# Altium project QuadcopterDesign.PrjPcb (part 3 of 4)

## Sheet [4] Wifi_ESP32_Antenna.SchDoc
size A4; Organization: UNMEI ELECTRICAL; Address1: 16B/12 Nguyen Du Street; Address2: Da Lat City, LD Province; SheetNumber: 4; SheetTotal: 7
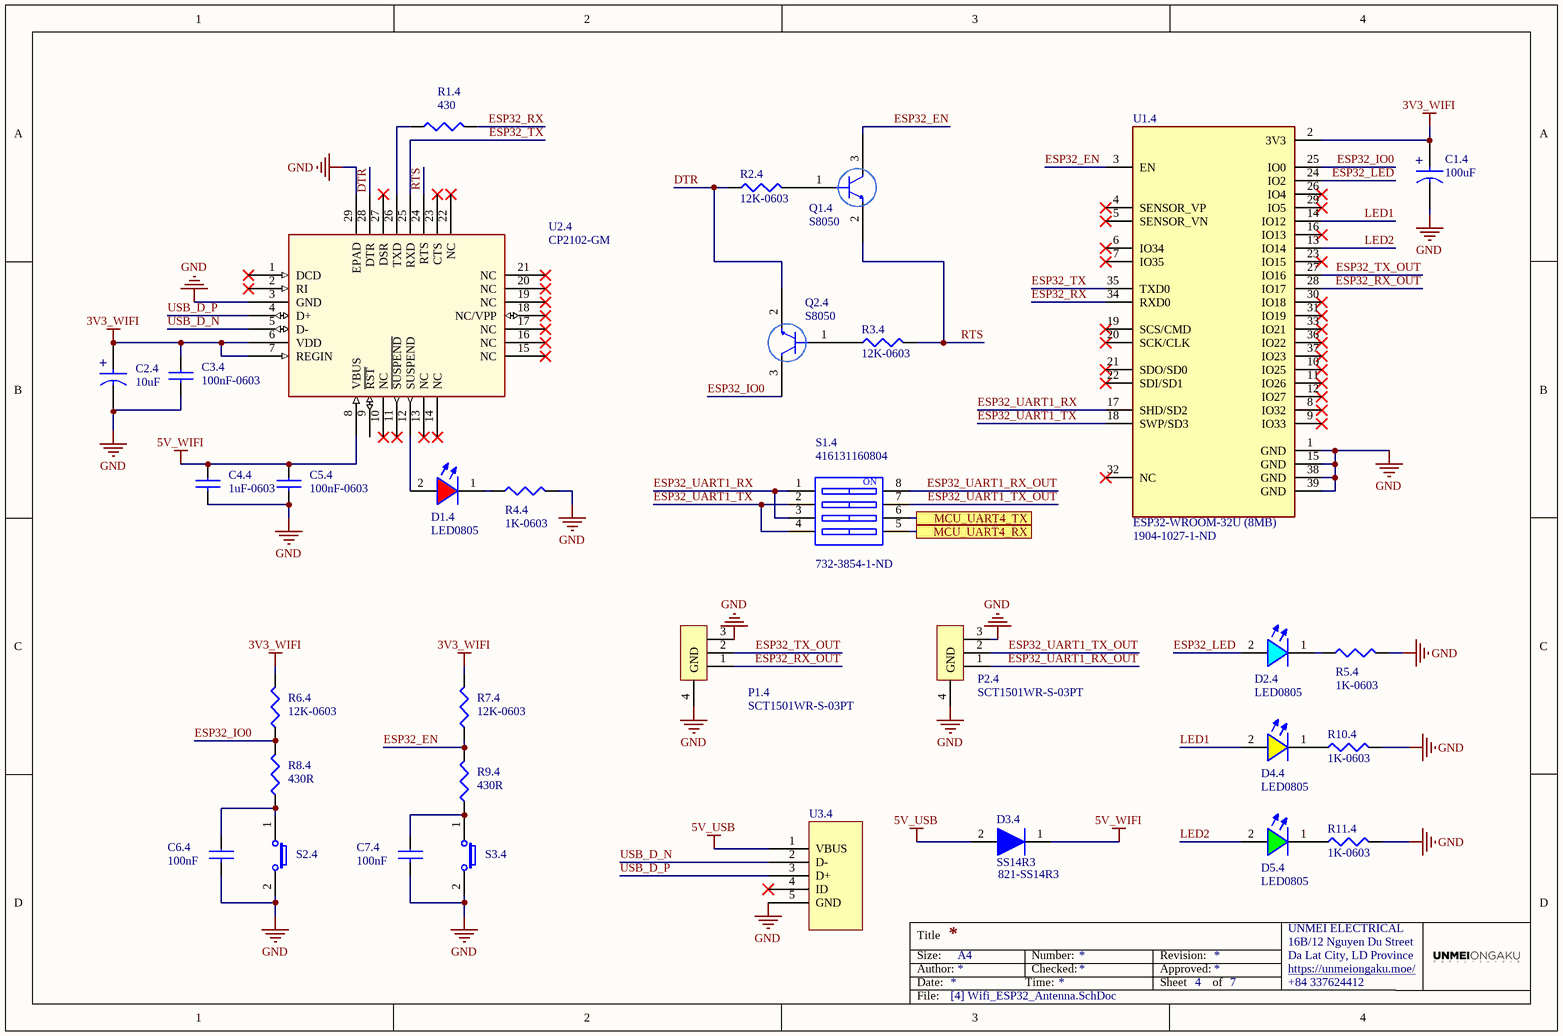
[diagram p3: [4] Wifi_ESP32_Antenna.SchDoc]

### Parts
C1.4  100uF  [Capacitor/Tantalum  - SMD6032/C - AVX]
C2.4  10uF  [Capacitor/Tantalum  - SMD3528/B - AVX]
C3.4  100nF-0603  [CAP0603]
C4.4  1uF-0603  [CAP0603]
C5.4  100nF-0603  [CAP0603]
C6.4  100nF  [CAP0603]
C7.4  100nF  [CAP0603]
D1.4  LED0805  [LED0805-RED]
D2.4  LED0805  [LED0805-BLUE]
D3.4  SS14R3  Supplier Part Number 1: 821-SS14R3  [SS14 - 1N5819 / DO-214AA, SMA]
D4.4  LED0805  [LED0805-YELLOW]
D5.4  LED0805  [LED0805-GREEN]
P1.4  SCT1501WR-S-03PT  [Connector ZH1.5 3P SMD]
P2.4  SCT1501WR-S-03PT  [Connector ZH1.5 3P SMD]
Q1.4  S8050  [SOT23]
Q2.4  S8050  [SOT23]
R1.4  430  [RES0603 - 3D]
R2.4  12K-0603  [RES0603 - 3D]
R3.4  12K-0603  [RES0603 - 3D]
R4.4  1K-0603  [RES0603 - 3D]
R5.4  1K-0603  [RES0603 - 3D]
R6.4  12K-0603  [RES0603 - 3D]
R7.4  12K-0603  [RES0603 - 3D]
R8.4  430R  [RES0603 - 3D]
R9.4  430R  [RES0603 - 3D]
R10.4  1K-0603  [RES0603 - 3D]
R11.4  1K-0603  [RES0603 - 3D]
S1.4  416131160804  Supplier Part Number 1: 732-3854-1-ND  [DIP Switches SMD 1.27mm 4P]
S2.4  434121043816  [Switches-6x3.5x4.3mm]  (value not drawn)
S3.4  434121043816  [Switches-6x3.5x4.3mm]  (value not drawn)
U1.4  ESP32-WROOM-32U (8MB)  Supplier Part Number 1: 1904-1027-1-ND  [ESP32 WROOM 32U]
U2.4  CP2102-GM  [QFN28_5X5_SIL]
U3.4  Micro USB - UJ2-MIBH-G-SMT-TR  [Micro USB V2 SMD]  (value not drawn)

### Ports
MCU_UART4_RX, MCU_UART4_TX

### Nets
3V3_WIFI: C1.4.1 C2.4.1 C3.4.1 R6.4.2 R7.4.2 U1.4.2(3V3) U2.4.6(VDD) U2.4.7(REGIN)
5V_USB: D3.4.2 U3.4.1(VBUS)
5V_WIFI: C4.4.1 C5.4.1 D3.4.1 U2.4.8(VBUS)
GND: C1.4.2 C2.4.2 C3.4.2 C4.4.2 C5.4.2 C6.4.2 C7.4.2 P1.4.3 P1.4.4(GND) P2.4.3 P2.4.4(GND) R4.4.2 R5.4.2 R10.4.2 R11.4.2 S2.4.2 S3.4.2 U1.4.1(GND) U1.4.15(GND) U1.4.38(GND) U1.4.39(GND) U2.4.3(GND) U2.4.29(EPAD) U3.4.5(GND)
DTR: Q2.4.2 R2.4.1 U2.4.28(DTR)
ESP32_EN: Q1.4.3 R7.4.1 R9.4.2 U1.4.3(EN)
ESP32_IO0: Q2.4.3 R6.4.1 R8.4.2 U1.4.25(IO0)
ESP32_LED: D2.4.2(+) U1.4.24(IO2)
ESP32_RX: R1.4.2 U1.4.34(RXD0)
ESP32_RX_OUT: P1.4.1 U1.4.28(IO17)
ESP32_TX: U1.4.35(TXD0) U2.4.25(RXD)
ESP32_TX_OUT: P1.4.2 U1.4.27(IO16)
ESP32_UART1_RX: S1.4.1 S1.4.3 U1.4.17(SHD/SD2)
ESP32_UART1_RX_OUT: P2.4.1 S1.4.8
ESP32_UART1_TX: S1.4.2 S1.4.4 U1.4.18(SWP/SD3)
ESP32_UART1_TX_OUT: P2.4.2 S1.4.7
LED1: D4.4.2(+) U1.4.14(IO12)
LED2: D5.4.2(+) U1.4.13(IO14)
MCU_UART4_RX: S1.4.5 ; port MCU_UART4_RX
MCU_UART4_TX: S1.4.6 ; port MCU_UART4_TX
RTS: Q1.4.2 R3.4.2 U2.4.24(RTS)
USB_D_N: U2.4.5(D-) U3.4.2(D-)
USB_D_P: U2.4.4(D+) U3.4.3(D+)
NetC6.4_1: C6.4.1 R8.4.1 S2.4.1
NetC7.4_1: C7.4.1 R9.4.1 S3.4.1
NetD1.4_1: D1.4.1(+) R4.4.1
NetD1.4_2: D1.4.2(+) U2.4.12(SUSPEND)
NetD2.4_1: D2.4.1(+) R5.4.1
NetD4.4_1: D4.4.1(+) R10.4.1
NetD5.4_1: D5.4.1(+) R11.4.1
NetQ1.4_1: Q1.4.1 R2.4.2
NetQ2.4_1: Q2.4.1 R3.4.1
NetR1.4_1: R1.4.1 U2.4.26(TXD)

Not connected (* = marked no-connect by the designer): U1.4 4(SENSOR_VP)* 5(SENSOR_VN)* 6(IO34)* 7(IO35)* 8(IO32)* 9(IO33)* 10(IO25)* 11(IO26)* 12(IO27)* 16(IO13)* 19(SCS/CMD)* 20(SCK/CLK)* 21(SDO/SD0)* 22(SDI/SD1)* 23(IO15)* 26(IO4)* 29(IO5)* 30(IO18)* 31(IO19)* 32(NC)* 33(IO21)* 36(IO22)* 37(IO23)*; U2.4 1(DCD)* 2(RI)* 9(~{RST}) 10(NC)* 11(~{SUSPEND})* 13(NC)* 14(NC)* 15(NC)* 16(NC)* 17(NC)* 18(NC/VPP)* 19(NC)* 20(NC)* 21(NC)* 22(NC)* 23(CTS)* 27(DSR)*; U3.4 4(ID)*

### Notes on the sheet
- Title
- Size:
- Date:
- Author:
- A4
- Time:
- Number:
- Checked:
- Revision:
- Sheet
- Approved:
- of
- https://unmeiongaku.moe/
- +84 337624412
- File:
- (in symbol 416131160804) ON
- (in symbol TAJB106K016RNJ) +
- (in symbol TAJC107K006RNJ) +

### Library data of the parts
C1.4 = TAJC107K006RNJ: 钽电容 100uF ±10% 6.3V 0.9Ω C型6032; Manufacturer: Kyocera AVX; Dielectric Material: Tantalum; ESR (Equivalent Series Resistance): 900mR; Leakage Current: 6.3uA; Polarity: Polar; Dissipation Factor: 6%; Supplier 1: RSComponents; Manufacturer Part Number: TAJC107K006RNJ; RoHS: Yes; Category: Tantalum Capacitors; Stock 1: 1; Pricing 1: 20=0.52900, 100=0.36400, 400=0.34700, 1000=0.21400 (USD); Mount: Surface Mount; Case/Package: Molded; Case Code (Metric): 6032; Case Code (Imperial): 2312; Min Operating Temperature: -55°C; Max Operating Temperature: 125°C; Capacitance: 100uF; Tolerance: 10%; Packaging: Tape and Reel; Voltage Rating: 6.3V; Package Quantity: 1; Termination: SMD/SMT; Features: General Purpose; Series: TAJ; Construction: Flat; Length: 6mm; Width: 3.2mm; Height: 2.6mm; Depth: 3.2mm; Height - Seated (Max): 0.11inch; Radiation Hardening: No; REACH SVHC: No SVHC; Lead Free: Lead Free; RoHS Compliant: Yes; ComponentLink1URL: https://datasheet.ciiva.com/26341/559444-da-01-en-tacc-c-6-0-mm-x-3-2-mm-x-2-6-mm-100-uf-26341781.pdf?src-supplier=Conrad; ComponentLink1Description: https://datasheet.ciiva.com/26341/559444-da-01-en-tacc-c-6-0-mm-x-3-2-mm-x-2-6-mm-100-uf-26341781.pdf?src-supplier=Conrad; ComponentLink2URL: https://datasheet.ciiva.com/18710/taj-eng-18710877.pdf?src-supplier=Distrelec; ComponentLink2Description: https://datasheet.ciiva.com/18710/taj-eng-18710877.pdf?src-supplier=Distrelec; ComponentLink3URL: https://datasheet.ciiva.com/7720/1680476-7720614.pdf?src-supplier=Element14; ComponentLink3Description: https://datasheet.ciiva.com/7720/1680476-7720614.pdf?src-supplier=Element14; ComponentLink4URL: https://datasheet.ciiva.com/7720/1680476-7720613.pdf?src-supplier=Element14; ComponentLink4Description: https://datasheet.ciiva.com/7720/1680476-7720613.pdf?src-supplier=Element14; ComponentLink5URL: https://datasheet.ciiva.com/264/taj-264329.pdf?src-supplier=Digi-Key; ComponentLink5Description: https://datasheet.ciiva.com/264/taj-264329.pdf?src-supplier=Digi-Key; ComponentLink6URL: https://datasheet.ciiva.com/264/taj-264328.pdf?src-supplier=Digi-Key; ComponentLink6Description: https://datasheet.ciiva.com/264/taj-264328.pdf?src-supplier=Digi-Key; ComponentLink7URL: https://datasheet.ciiva.com/264/taj-264330.pdf?src-supplier=Digi-Key; ComponentLink7Description: https://datasheet.ciiva.com/264/taj-264330.pdf?src-supplier=Digi-Key; ComponentLink8URL: https://datasheet.ciiva.com/12910/taj-27497-12910474.pdf?src-supplier=Mouser; ComponentLink8Description: https://datasheet.ciiva.com/12910/taj-27497-12910474.pdf?src-supplier=Mouser; ComponentLink9URL: https://datasheet.ciiva.com/3004/taj-3004480.pdf?src-supplier=Avnet; ComponentLink9Description: https://datasheet.ciiva.com/3004/taj-3004480.pdf?src-supplier=Avnet; ComponentLink10URL: https://datasheet.ciiva.com/3004/taj-3004481.pdf?src-supplier=Avnet; ComponentLink10Description: https://datasheet.ciiva.com/3004/taj-3004481.pdf?src-supplier=Avnet; Supplier Part Number 1: 1364517
C2.4 = TAJB106K016RNJ: 钽电容 10uF ±10% 16V 2.8Ω B型3528; Manufacturer: Kyocera AVX; Dielectric Material: Tantalum; ESR (Equivalent Series Resistance): 2.8R; Leakage Current: 1.6uA; Voltage: 10V; Dissipation Factor: 6%; Polarity: Polar; Supplier 1: Newark; Manufacturer Part Number: TAJB106K016RNJ; RoHS: Yes; Category: Tantalum Capacitors; Stock 1: 2000; Pricing 1: 1=0.15600, 2000=0.15600 (USD); Mount: Surface Mount,PCB; Case/Package: 1210; Number of Pins: 2; Case Code (Metric): 3528; Case Code (Imperial): 1210; Min Operating Temperature: -55°C; Max Operating Temperature: 125°C; Capacitance: 10uF; Tolerance: 10%; Packaging: Tape and Reel; Voltage Rating (DC): 16V; Package Quantity: 1; Voltage Rating: 16V; Termination: SMD/SMT; Features: General Purpose; Series: TAJ; Construction: Flat; Length: 3.5mm; Width: 0.11inch; Height: 1.9mm; Depth: 2.8mm; Height - Seated (Max): 0.083inch; Lead Pitch: 1.4mm; Radiation Hardening: No; REACH SVHC: No SVHC; Lead Free: Lead Free; RoHS Compliant: Yes; ComponentLink1URL: https://datasheet.ciiva.com/26341/559424-da-01-en-tacc-b-3-2-mm-x-2-5-mm-x-1-9-mm-10-uf-26341768.pdf?src-supplier=Conrad; ComponentLink1Description: https://datasheet.ciiva.com/26341/559424-da-01-en-tacc-b-3-2-mm-x-2-5-mm-x-1-9-mm-10-uf-26341768.pdf?src-supplier=Conrad; ComponentLink2URL: https://datasheet.ciiva.com/18710/taj-eng-18710629.pdf?src-supplier=Distrelec; ComponentLink2Description: https://datasheet.ciiva.com/18710/taj-eng-18710629.pdf?src-supplier=Distrelec; ComponentLink3URL: https://datasheet.ciiva.com/7730/1680476-7730725.pdf?src-supplier=Element14; ComponentLink3Description: https://datasheet.ciiva.com/7730/1680476-7730725.pdf?src-supplier=Element14; ComponentLink4URL: https://datasheet.ciiva.com/28608/taj-28608982.pdf?src-supplier=Element14; ComponentLink4Description: https://datasheet.ciiva.com/28608/taj-28608982.pdf?src-supplier=Element14; ComponentLink5URL: https://datasheet.ciiva.com/263/taj-263602.pdf?src-supplier=Digi-Key; ComponentLink5Description: https://datasheet.ciiva.com/263/taj-263602.pdf?src-supplier=Digi-Key; ComponentLink6URL: https://datasheet.ciiva.com/263/taj-263601.pdf?src-supplier=Digi-Key; ComponentLink6Description: https://datasheet.ciiva.com/263/taj-263601.pdf?src-supplier=Digi-Key; ComponentLink7URL: https://datasheet.ciiva.com/263/taj-263603.pdf?src-supplier=Digi-Key; ComponentLink7Description: https://datasheet.ciiva.com/263/taj-263603.pdf?src-supplier=Digi-Key; ComponentLink8URL: https://datasheet.ciiva.com/12911/taj-27497-12911721.pdf?src-supplier=Mouser; ComponentLink8Description: https://datasheet.ciiva.com/12911/taj-27497-12911721.pdf?src-supplier=Mouser; ComponentLink9URL: https://datasheet.ciiva.com/14587/70001050-14587351.pdf?src-supplier=Allied+Electronics; ComponentLink9Description: https://datasheet.ciiva.com/14587/70001050-14587351.pdf?src-supplier=Allied+Electronics; ComponentLink10URL: https://datasheet.ciiva.com/3004/taj-3004425.pdf?src-supplier=Avnet; ComponentLink10Description: https://datasheet.ciiva.com/3004/taj-3004425.pdf?src-supplier=Avnet; ComponentLink11URL: https://datasheet.ciiva.com/16385/taj-16385095.pdf?src-supplier=Future+Electronics; ComponentLink11Description: https://datasheet.ciiva.com/16385/taj-16385095.pdf?src-supplier=Future+Electronics; ComponentLink12URL: https://datasheet.ciiva.com/15163/getdatasheetpartid-120870-15163420.pdf?src-supplier=Verical; ComponentLink12Description: https://datasheet.ciiva.com/15163/getdatasheetpartid-120870-15163420.pdf?src-supplier=Verical; ComponentLink13URL: https://datasheet.ciiva.com/25913/taj-25913340.pdf?src-supplier=Avnet+Europe; ComponentLink13Description: https://datasheet.ciiva.com/25913/taj-25913340.pdf?src-supplier=Avnet+Europe; ComponentLink14URL: https://datasheet.ciiva.com/16538/taj-16538428.pdf?src-supplier=Avnet+Asia; ComponentLink14Description: https://datasheet.ciiva.com/16538/taj-16538428.pdf?src-supplier=Avnet+Asia; Supplier Part Number 1: 30H0311
C3.4 C5.4 = CC0603KRX7R9BB104: CAP CER 0.1UF 50V X7R 0603; Manufacturer 1: Yageo; Category 1: Capacitors; Capacitance: 0.1µF; Tolerance: ±10%; Value: 100nF; Supplier 1: Digi-Key; Supplier Part Number 1: 311-1344-1-ND; Manufacturer Part Number 1: CC0603KRX7R9BB104; RoHS 1: RoHS Compliant; Description 1: CAP CER 0.1UF 50V X7R 0603; Stock 1: 4411645; Pricing 1: 1=0.1, 10=0.031, 100=0.014, 500=0.00998, 1000=0.00783 (USD); Packaging: Cut Tape (CT); Part Status: Active; Voltage - Rated: 50V; Temperature Coefficient: X7R; Operating Temperature: -55°C ~ 125°C; Features: -; Ratings: -; Applications: General Purpose; Failure Rate: -; Mounting Type: Surface Mount, MLCC; Package / Case: 0603 (1608 Metric); Size / Dimension: 0.063" L x 0.031" W (1.60mm x 0.80mm); Height - Seated (Max): -; Thickness (Max): 0.035" (0.90mm); Lead Spacing: -; Lead Style: -; ComponentLink1URL: http://www.yageo.com/documents/recent/UPY-GPHC_X7R_6.3V-to-50V_18.pdf; ComponentLink1Description: http://www.yageo.com/documents/recent/UPY-GPHC_X7R_6.3V-to-50V_18.pdf
C4.4 = CC0603KRX7R7BB105: CAP CER 1UF 16V X7R 0603; Manufacturer 1: Yageo; Category 1: Capacitors; Capacitance: 1µF; Tolerance: ±10%; Supplier 1: Digi-Key; Supplier Part Number 1: 311-1446-1-ND; Manufacturer Part Number 1: CC0603KRX7R7BB105; RoHS 1: RoHS Compliant; Description 1: CAP CER 1UF 16V X7R 0603; Stock 1: 274580; Pricing 1: 1=0.1, 10=0.051, 100=0.0227, 500=0.0162, 1000=0.01274 (USD); Packaging: Cut Tape (CT); Part Status: Active; Voltage - Rated: 16V; Temperature Coefficient: X7R; Operating Temperature: -55°C ~ 125°C; Features: -; Ratings: -; Applications: General Purpose; Failure Rate: -; Mounting Type: Surface Mount, MLCC; Package / Case: 0603 (1608 Metric); Size / Dimension: 0.063" L x 0.031" W (1.60mm x 0.80mm); Height - Seated (Max): -; Thickness (Max): 0.035" (0.90mm); Lead Spacing: -; Lead Style: -; ComponentLink1URL: http://www.yageo.com/documents/recent/UPY-GPHC_X7R_6.3V-to-50V_18.pdf; ComponentLink1Description: http://www.yageo.com/documents/recent/UPY-GPHC_X7R_6.3V-to-50V_18.pdf; Value: 1uF
C6.4 C7.4 = CC0603KRX7R9BB104: as C1.2 on sheet [2] MicroController; Supplier 1: Digi-Key; Supplier Part Number 1: 311-1344-1-ND; Manufacturer Part Number 1: CC0603KRX7R9BB104; RoHS 1: RoHS Compliant; Description 1: CAP CER 0.1UF 50V X7R 0603; Stock 1: 4411645; Pricing 1: 1=0.1, 10=0.031, 100=0.014, 500=0.00998, 1000=0.00783 (USD); Packaging: Cut Tape (CT); Part Status: Active; Voltage - Rated: 50V; Temperature Coefficient: X7R; Operating Temperature: -55°C ~ 125°C; Features: -; Ratings: -; Applications: General Purpose; Failure Rate: -; Mounting Type: Surface Mount, MLCC; Package / Case: 0603 (1608 Metric); Size / Dimension: 0.063" L x 0.031" W (1.60mm x 0.80mm); Height - Seated (Max): -; Thickness (Max): 0.035" (0.90mm); Lead Spacing: -; Lead Style: -; ComponentLink1URL: http://www.yageo.com/documents/recent/UPY-GPHC_X7R_6.3V-to-50V_18.pdf; ComponentLink1Description: http://www.yageo.com/documents/recent/UPY-GPHC_X7R_6.3V-to-50V_18.pdf; Value: 100nF
D1.4 = LED0805-RED
D2.4 = LED0805-BLUE
D3.4 = SS14R3: 1A, 40V, Schottky Rectifier; Manufacturer: Taiwan Semiconductor; Supplier 1: Mouser; Manufacturer Part Number: SS14R3; RoHS: Yes; Category: Uncategorized; Stock 1: 5400; Pricing 1: 3600=0.07700, 9000=0.06800, 10000=0.06800, 23400=0.06400, 48600=0.05800 (USD); Case/Package: SMA; Number of Pins: 2; ComponentLink1URL: http://components.arrow.com/part/dataview/0323_01151906?src-supplier=Arrow+Europe; ComponentLink1Description: http://components.arrow.com/part/dataview/0323_01151906?src-supplier=Arrow+Europe
D4.4 = LED0805-YELLOW
D5.4 = LED0805-GREEN
Q1.4 Q2.4 = MMS8050-H-TP: Trans Gp Bjt NPN 25V 0.5A 3-PIN SOT-23 T/r; Manufacturer: MCC; Max Collector Current: 500mA; Collector Emitter Voltage (VCEO): 600mV; Max Power Dissipation: 300mW; Transition Frequency: 150MHz; Supplier 1: Mouser; Manufacturer Part Number: MMS8050-H-TP; RoHS: Yes; Category: Uncategorized; Stock 1: 417; Pricing 1: 1=0.21000, 10=0.17100, 50=0.17100, 100=0.09100, 1000=0.04100, 10000=0.02700 (USD); Mount: Surface Mount; Case/Package: TO-236-3; Number of Pins: 3; Min Operating Temperature: -55°C; Max Operating Temperature: 150°C; Packaging: Tape and Reel; Collector Emitter Breakdown Voltage: 25V; RoHS Compliant: Yes; ComponentLink1URL: http://components.arrow.com/part/dataview/56206496S302966N2022?src-supplier=Arrow+Electronics; ComponentLink1Description: http://components.arrow.com/part/dataview/56206496S302966N2022?src-supplier=Arrow+Electronics; ComponentLink2URL: http://www.mccsemi.com/up_pdf/MMS8050(SOT-23).pdf?src-supplier=Digi-Key; ComponentLink2Description: http://www.mccsemi.com/up_pdf/MMS8050(SOT-23).pdf?src-supplier=Digi-Key; Supplier Part Number 1: 833-MMS8050-H-TP
R1.4 = RC0603JR-07430RL: Res Thick Film 0603 430 Ohm 5% 0.1W(1/10W) ±100ppm/C Pad SMD T/R; Manufacturer: Yageo; Resistance: 430R; Power Rating: 100mW; Voltage Rating: 75V; Temperature Coefficient: 100ppm/°C; Voltage Rating (DC): 50V; Supplier 1: Arrow Electronics; Manufacturer Part Number: RC0603JR-07430RL; RoHS: Yes; Category: Chip SMD Resistors; Stock 1: 4860; Pricing 1: 1=0.08790, 10=0.01230, 25=0.01220, 100=0.00530, 250=0.00520, 1000=0.00260, 3000=0.00190 (USD); Case/Package: 0603; Case Code (Metric): 1608; Case Code (Imperial): 0603; Weight: 7.1E-05oz; Size Code: 0603; Min Operating Temperature: -55°C; Max Operating Temperature: 155°C; Package Quantity: 1; Tolerance: 5%; Packaging: Tape and Reel; Resistor Type: Thick Film; Number of Terminations: 2; Termination: SMD/SMT; Max Power Dissipation: 100mW; Features: Moisture Resistant; Series: RC; Construction: Rectangular; Length: 1.6mm; Width: 0.031inch; Height: 0.022inch; Depth: 0.8mm; Military Standard: Not; Lead Free: Lead Free; RoHS Compliant: Yes; ComponentLink1URL: https://datasheet.ciiva.com/2452/pyu-r-int-thick-7-2452930.pdf?src-supplier=Digi-Key; ComponentLink1Description: https://datasheet.ciiva.com/2452/pyu-r-int-thick-7-2452930.pdf?src-supplier=Digi-Key; ComponentLink2URL: https://datasheet.ciiva.com/2452/pyu-r-int-thick-7-2452931.pdf?src-supplier=Digi-Key; ComponentLink2Description: https://datasheet.ciiva.com/2452/pyu-r-int-thick-7-2452931.pdf?src-supplier=Digi-Key; ComponentLink3URL: https://datasheet.ciiva.com/2452/pyu-r-int-thick-7-2452929.pdf?src-supplier=Digi-Key; ComponentLink3Description: https://datasheet.ciiva.com/2452/pyu-r-int-thick-7-2452929.pdf?src-supplier=Digi-Key; Supplier Part Number 1: RC0603JR-07430RL
R2.4 R3.4 R6.4 R7.4 = RC0603JR-0712KL: Thick Film Resistors - SMD 12K OHM 5%; Manufacturer: Yageo; Power Rating: 100 mW (1/10 W); Resistance: 12 kOhms; Temperature Coefficient: 100 PPM / C; Voltage Rating: 75 V; Supplier 1: Mouser; Manufacturer Part Number: RC0603JR-0712KL; RoHS: RoHS Compliant; Category: Thick Film Resistors - SMD; Stock 1: 29553; Pricing 1: 1=0.100, 10=0.008, 100=0.002, 5000=0.002 (USD); Features: RC0603 series chip resistors with lead-free terminations; Height: 0.45 mm; Length: 1.6 mm; Package / Case: 0603 (1608 metric); Packaging: Cut Tape; Product: Thick Film Resistors General Purpose; Series: RC-L; Termination Style: SMD/SMT; Tolerance: 5 %; Type: General Purpose Resistor; Width: 0.8 mm; Brand: Yageo; Case Code - in: 0603; Case Code - mm: 1608; Maximum Operating Temperature: + 155 C; Minimum Operating Temperature: - 55 C; Standard Pack Qty: 5000; RoHS - Mouser: Y; Minimum Order Quantity: 1; Reeling: True; ComponentLink1URL: https://www.mouser.com/ds/2/447/RC0603-1212058.pdf; ComponentLink1Description: https://www.mouser.com/ds/2/447/RC0603-1212058.pdf; Supplier Part Number 1: 603-RC0603JR-0712KL; Value: 12K
R4.4 R5.4 R10.4 R11.4 = RC0603JR-071KL: RES SMD 1K OHM 5% 1/10W 0603; Manufacturer 1: Yageo; Category 1: Resistors; Power (Watts): 0.1W, 1/10W; Temperature Coefficient: ±100ppm/°C; Supplier 1: Digi-Key; Supplier Part Number 1: 311-1.0KGRCT-ND; Manufacturer Part Number 1: RC0603JR-071KL; RoHS 1: RoHS Compliant; Description 1: RES SMD 1K OHM 5% 1/10W 0603; Stock 1: 2853955; Pricing 1: 1=0.1, 10=0.011, 100=0.0044, 1000=0.00198, 2500=0.00172 (USD); Packaging: Cut Tape (CT); Part Status: Active; Resistance (Ohms): 1k; Tolerance: ±5%; Composition: Thick Film; Features: Moisture Resistant; Operating Temperature: -55°C ~ 155°C; Package / Case: 0603 (1608 Metric); Supplier Device Package: 0603; Size / Dimension: 0.063" L x 0.031" W (1.60mm x 0.80mm); Height - Seated (Max): 0.022" (0.55mm); Failure Rate: -; ComponentLink1URL: http://www.yageo.com/documents/recent/PYu-RC_Group_51_RoHS_L_7.pdf; ComponentLink1Description: http://www.yageo.com/documents/recent/PYu-RC_Group_51_RoHS_L_7.pdf; Value: 1K
R8.4 R9.4 = RC0603JR-07430RL: Res Thick Film 0603 430 Ohm 5% 0.1W(1/10W) ±100ppm/C Pad SMD T/R; Manufacturer: Yageo; Power Rating: 100mW; Voltage Rating: 75V; Temperature Coefficient: 100ppm/°C; Voltage Rating (DC): 50V; Supplier 1: Arrow Electronics; Manufacturer Part Number: RC0603JR-07430RL; RoHS: Yes; Category: Chip SMD Resistors; Stock 1: 4860; Pricing 1: 1=0.08790, 10=0.01230, 25=0.01220, 100=0.00530, 250=0.00520, 1000=0.00260, 3000=0.00190 (USD); Case/Package: 0603; Case Code (Metric): 1608; Case Code (Imperial): 0603; Weight: 7.1E-05oz; Size Code: 0603; Min Operating Temperature: -55°C; Max Operating Temperature: 155°C; Package Quantity: 1; Resistance: 430R; Tolerance: 5%; Packaging: Tape and Reel; Resistor Type: Thick Film; Number of Terminations: 2; Termination: SMD/SMT; Max Power Dissipation: 100mW; Features: Moisture Resistant; Series: RC; Construction: Rectangular; Length: 1.6mm; Width: 0.031inch; Height: 0.022inch; Depth: 0.8mm; Military Standard: Not; Lead Free: Lead Free; RoHS Compliant: Yes; ComponentLink1URL: https://datasheet.ciiva.com/2452/pyu-r-int-thick-7-2452930.pdf?src-supplier=Digi-Key; ComponentLink1Description: https://datasheet.ciiva.com/2452/pyu-r-int-thick-7-2452930.pdf?src-supplier=Digi-Key; ComponentLink2URL: https://datasheet.ciiva.com/2452/pyu-r-int-thick-7-2452931.pdf?src-supplier=Digi-Key; ComponentLink2Description: https://datasheet.ciiva.com/2452/pyu-r-int-thick-7-2452931.pdf?src-supplier=Digi-Key; ComponentLink3URL: https://datasheet.ciiva.com/2452/pyu-r-int-thick-7-2452929.pdf?src-supplier=Digi-Key; ComponentLink3Description: https://datasheet.ciiva.com/2452/pyu-r-int-thick-7-2452929.pdf?src-supplier=Digi-Key; Supplier Part Number 1: RC0603JR-07430RL
S1.4 = 416131160804: DIP Switch Dimensions L x W x H: 5.6 x 2 mm Series: WS-DISV L: 6.12 mm Poles: 4; Manufacturer: Wurth Electronics; Body Material: Polyphenylene,Polyphthalamide; Mechanical Life: 2000Cycles; Contact Resistance: 50mR; Contact Current Rating: 25mA; Number of Positions: 4; Voltage Rating (DC): 24V; Electrical Life: 1000Cycles; Throw Configuration: SPST; Insulation Resistance: 100MR; Actuator Type: Slide (Standard); Pitch: 0.05inch; Washable: Yes; Supplier 1: Digi-Key; Manufacturer Part Number: 416131160804; RoHS: Yes; Category: DIP Switches; Stock 1: 13030; Pricing 1: 1=5.25000, 10=5.08200, 50=4.81400, 100=4.27900, 500=4.01200 (USD); Mount: Surface Mount; Contact Material: Copper Alloy,Gold; Contact Plating: Gold; Min Operating Temperature: -40°C; Max Operating Temperature: 85°C; Package Quantity: 1; Packaging: Cut Tape; Current Rating: 25mA; Termination: Gull Wing; Number of Circuits: 4; Max Voltage Rating (DC): 24V; Series: WS-DISV; Length: 0.241inch; Width: 5.6mm; Height: 2mm; Reach SVHC Compliant: Yes; Lead Free: Lead Free; RoHS Compliant: Yes; ComponentLink1URL: https://datasheet.ciiva.com/30467/0900766b812902d9-30467107.pdf?src-supplier=RSComponents; ComponentLink1Description: https://datasheet.ciiva.com/30467/0900766b812902d9-30467107.pdf?src-supplier=RSComponents; ComponentLink2URL: https://datasheet.ciiva.com/1528/4161311608xx-1528928.pdf?src-supplier=Element14; ComponentLink2Description: https://datasheet.ciiva.com/1528/4161311608xx-1528928.pdf?src-supplier=Element14; ComponentLink3URL: https://datasheet.ciiva.com/2863/4161311608xx-2863702.pdf?src-supplier=Digi-Key; ComponentLink3Description: https://datasheet.ciiva.com/2863/4161311608xx-2863702.pdf?src-supplier=Digi-Key; ComponentLink4URL: https://datasheet.ciiva.com/2863/4161311608xx-2863701.pdf?src-supplier=Digi-Key; ComponentLink4Description: https://datasheet.ciiva.com/2863/4161311608xx-2863701.pdf?src-supplier=Digi-Key; ComponentLink5URL: https://datasheet.ciiva.com/1625/4161311608xx-1625344.pdf?src-supplier=Farnell; ComponentLink5Description: https://datasheet.ciiva.com/1625/4161311608xx-1625344.pdf?src-supplier=Farnell
S2.4 S3.4 = 434121043816: Switch Tactile Spst-no 0.05A 12V; Manufacturer: Wurth Electronics; Mechanical Life: 50000Cycles; Actuator Material: Polymer,Liquid Crystal Polymer; Contact Current Rating: 50mA; Operating Force: 160gf; Illumination Type: Non-Illuminated,Illuminated; Throw Configuration: SPST; Insulation Resistance: 100MR; Switch Travel: 0.25mm; Switch Function: Off-Mom; Actuator Length: 0.8mm; Supplier 1: RSComponents; Manufacturer Part Number: 434121043816; RoHS: Yes; Category: Tactile Switches; Stock 1: 337; Pricing 1: 1=1.69500 (USD); Mount: Surface Mount; Contact Material: Stainless Steel,Steel; Min Operating Temperature: -40°C; Max Operating Temperature: 85°C; Current Rating: 50mA; Packaging: Tape and Reel; Termination: SMD/SMT; Series: WS-TASV; Contact Type: 1 maker; Length: 8mm; Width: 3.5mm; Height: 4.3mm; REACH SVHC: No SVHC; RoHS Compliant: Yes; ComponentLink1URL: https://datasheet.ciiva.com/30466/0900766b8126b631-30466746.pdf?src-supplier=RSComponents; ComponentLink1Description: https://datasheet.ciiva.com/30466/0900766b8126b631-30466746.pdf?src-supplier=RSComponents; ComponentLink2URL: https://datasheet.ciiva.com/29123/711754-da-01-en-taster-434121043816-29123819.pdf?src-supplier=Conrad; ComponentLink2Description: https://datasheet.ciiva.com/29123/711754-da-01-en-taster-434121043816-29123819.pdf?src-supplier=Conrad; ComponentLink3URL: https://datasheet.ciiva.com/1532/434121043816-1532524.pdf?src-supplier=Element14; ComponentLink3Description: https://datasheet.ciiva.com/1532/434121043816-1532524.pdf?src-supplier=Element14; ComponentLink4URL: https://datasheet.ciiva.com/1633/434121043816-1633934.pdf?src-supplier=Farnell; ComponentLink4Description: https://datasheet.ciiva.com/1633/434121043816-1633934.pdf?src-supplier=Farnell; Supplier Part Number 1: 7856421
U1.4 = ESP32-WROOM-32U (8MB): SMD Module, ESP32-D0WD, 64MBITS Spi Flash, Uart Mode, U.fl Antenna Connector; Manufacturer: Espressif Systems; Interface: I2C,SPI,GPIO,PWM,SDIO,UART; Frequency: 2.5GHz; Data Rate: 150Mbps; Sensitivity: -98dBm; Memory Size: 536KB; Resistance: 4.48kR; Tolerance: 0.1%; Max Power Dissipation: 125mW; Temperature Coefficient: 25ppm/°C; Supplier 1: Digi-Key; Manufacturer Part Number: ESP32-WROOM-32U (8MB); RoHS: No; Category: RF Receivers, Transceivers; Mount: Surface Mount; Case/Package: SMD/SMT; Case Code (Imperial): 0805; Case Code (Metric): 2012; Min Operating Temperature: -40°C; Max Operating Temperature: 85°C; Packaging: Cut Tape; Resistor Type: Thin Film; Number of Terminations: 2; ComponentLink1URL: https://www.espressif.com/sites/default/files/documentation/esp32-wroom-32d_esp32-wroom-32u_datasheet_en.pdf?src-supplier=Digi-Key; ComponentLink1Description: https://www.espressif.com/sites/default/files/documentation/esp32-wroom-32d_esp32-wroom-32u_datasheet_en.pdf?src-supplier=Digi-Key
U2.4 = CP2102-GM: Vendor: Silicon Labs; Built_By: EMA_UL_Team; SourceLibrary: Silicon_Labs_2015-03-23; Manufacturer_Part_Number: CP2102-GM; Copyright: Copyright (C) 2018 Accelerated Designs. All rights reserved; RefDes: RefDes; Type: DEV; Local Supplier: thegioiic; Local Supplier Part Number: *; Local Supplier Link: https://www.thegioiic.com/products/cp2102
U3.4 = Micro USB - UJ2-MIBH-G-SMT-TR: Conn Micro USB 2.0 Type B RCP 5 POS 0.65mm Solder RA SMD 5 Terminal 1 Port T/R; Manufacturer: CUI Devices; Supplier 1: Arrow Electronics; Manufacturer Part Number: UJ2-MIBH-G-SMT-TR; RoHS: Yes; Category: USB Connectors; Stock 1: 6066; Pricing 1: 1=0.44640, 10=0.33470, 25=0.33130, 50=0.32680, 100=0.29350, 250=0.28070, 500=0.26500, 1000=0.21660, 2000=0.19850, 3000=0.19000, 5000=0.18820 (USD); Supplier Part Number 1: UJ2-MIBH-G-SMT-TR

## Sheet [5] Peripheral_Module.SchDoc
size A4; Organization: UNMEI ELECTRICAL; Address1: 16B/12 Nguyen Du Street; Address2: Da Lat City, LD Province; SheetNumber: 5; SheetTotal: 7
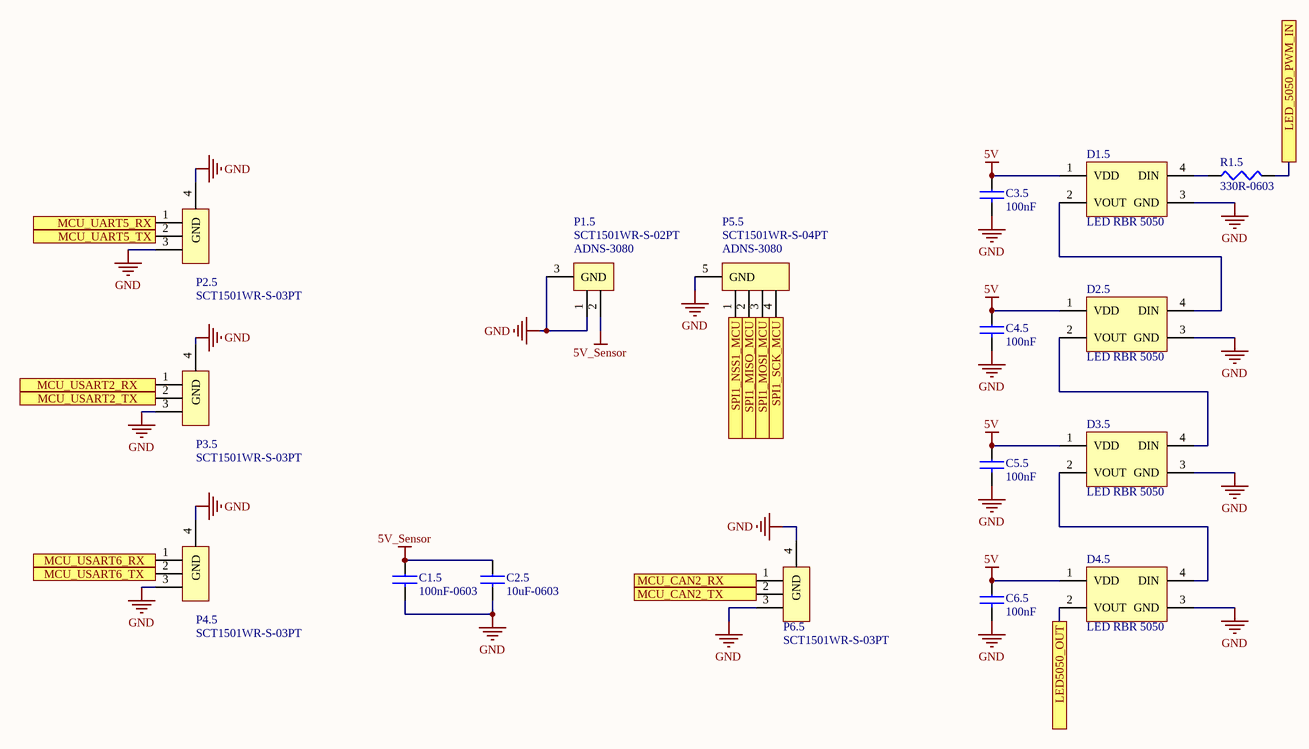
[diagram p4: [5] Peripheral_Module.SchDoc]

### Parts
C1.5  100nF-0603  [CAP0603]
C2.5  10uF-0603  [CAP0603]
C3.5  100nF  [CAP0603]
C4.5  100nF  [CAP0603]
C5.5  100nF  [CAP0603]
C6.5  100nF  [CAP0603]
D1.5  LED RBR 5050  [LED RGB  5050]
D2.5  LED RBR 5050  [LED RGB  5050]
D3.5  LED RBR 5050  [LED RGB  5050]
D4.5  LED RBR 5050  [LED RGB  5050]
P1.5  SCT1501WR-S-02PT  [Connector ZH1.5 2P SMD]
P2.5  SCT1501WR-S-03PT  [Connector ZH1.5 3P SMD]
P3.5  SCT1501WR-S-03PT  [Connector ZH1.5 3P SMD]
P4.5  SCT1501WR-S-03PT  [Connector ZH1.5 3P SMD]
P5.5  SCT1501WR-S-04PT  [Connector ZH1.5 4P SMD]
P6.5  SCT1501WR-S-03PT  [Connector ZH1.5 3P SMD]
R1.5  330R-0603  [RES0603 - 3D]

### Ports
LED5050_OUT, LED_5050_PWM_IN, MCU_CAN2_RX, MCU_CAN2_TX, MCU_UART5_RX, MCU_UART5_TX, MCU_USART2_RX, MCU_USART2_TX, MCU_USART6_RX, MCU_USART6_TX, SPI1_MISO_MCU, SPI1_MOSI_MCU, SPI1_NSS1_MCU, SPI1_SCK_MCU

### Nets
5V: C1.5.1 C2.5.1 C3.5.1 C4.5.1 C5.5.1 C6.5.1 D1.5.1(VDD) D2.5.1(VDD) D3.5.1(VDD) D4.5.1(VDD) P1.5.2  [also labelled 5V_Sensor]
GND: C1.5.2 C2.5.2 C3.5.2 C4.5.2 C5.5.2 C6.5.2 D1.5.3(GND) D2.5.3(GND) D3.5.3(GND) D4.5.3(GND) P1.5.1 P1.5.3(GND) P2.5.3 P2.5.4(GND) P3.5.3 P3.5.4(GND) P4.5.3 P4.5.4(GND) P5.5.5(GND) P6.5.3 P6.5.4(GND)
NetD1.5_2: D1.5.2(VOUT) D2.5.4(DIN)
NetD1.5_4: D1.5.4(DIN) R1.5.1
NetD2.5_2: D2.5.2(VOUT) D3.5.4(DIN)
NetD3.5_2: D3.5.2(VOUT) D4.5.4(DIN)
NetD4.5_2: D4.5.2(VOUT) ; port LED5050_OUT
NetP2.5_1: P2.5.1 ; port MCU_UART5_RX
NetP2.5_2: P2.5.2 ; port MCU_UART5_TX
NetP2.6_1: P5.5.4 ; port SPI1_SCK_MCU
NetP2.6_2: P5.5.3 ; port SPI1_MOSI_MCU
NetP2.6_3: P5.5.2 ; port SPI1_MISO_MCU
NetP3.5_1: P3.5.1 ; port MCU_USART2_RX
NetP3.5_2: P3.5.2 ; port MCU_USART2_TX
NetP4.5_1: P4.5.1 ; port MCU_USART6_RX
NetP4.5_2: P4.5.2 ; port MCU_USART6_TX
NetP5.5_1: P5.5.1 ; port SPI1_NSS1_MCU
NetP6.5_1: P6.5.1 ; port MCU_CAN2_RX
NetP6.5_2: P6.5.2 ; port MCU_CAN2_TX
NetR1.5_2: R1.5.2 ; port LED_5050_PWM_IN

### Notes on the sheet
- (near P1.5) ADNS-3080
- (near P5.5) ADNS-3080
- Title
- Size:
- Date:
- Author:
- A4
- Time:
- Number:
- Checked:
- Revision:
- Sheet
- Approved:
- of
- https://unmeiongaku.moe/
- +84 337624412
- File:

### Library data of the parts
C1.5 = CC0603KRX7R9BB104: as C3.4 on sheet [4] Wifi_ESP32_Antenna; Supplier 1: Digi-Key; Supplier Part Number 1: 311-1344-1-ND; Manufacturer Part Number 1: CC0603KRX7R9BB104; RoHS 1: RoHS Compliant; Description 1: CAP CER 0.1UF 50V X7R 0603; Stock 1: 4411645; Pricing 1: 1=0.1, 10=0.031, 100=0.014, 500=0.00998, 1000=0.00783 (USD); Packaging: Cut Tape (CT); Part Status: Active; Voltage - Rated: 50V; Temperature Coefficient: X7R; Operating Temperature: -55°C ~ 125°C; Features: -; Ratings: -; Applications: General Purpose; Failure Rate: -; Mounting Type: Surface Mount, MLCC; Package / Case: 0603 (1608 Metric); Size / Dimension: 0.063" L x 0.031" W (1.60mm x 0.80mm); Height - Seated (Max): -; Thickness (Max): 0.035" (0.90mm); Lead Spacing: -; Lead Style: -; ComponentLink1URL: http://www.yageo.com/documents/recent/UPY-GPHC_X7R_6.3V-to-50V_18.pdf; ComponentLink1Description: http://www.yageo.com/documents/recent/UPY-GPHC_X7R_6.3V-to-50V_18.pdf
C2.5 = CC0603KRX5R6BB106: CAP CER 10UF 10V X5R 0603; Manufacturer 1: Yageo; Category 1: Capacitors; Capacitance: 10µF; Tolerance: ±10%; Supplier 1: Digi-Key; Supplier Part Number 1: 311-1782-1-ND; Manufacturer Part Number 1: CC0603KRX5R6BB106; RoHS 1: RoHS Compliant; Description 1: CAP CER 10UF 10V X5R 0603; Stock 1: 66566; Pricing 1: 1=0.33, 10=0.225, 100=0.1272, 500=0.08982, 1000=0.07858 (USD); Packaging: Cut Tape (CT); Part Status: Active; Voltage - Rated: 10V; Temperature Coefficient: X5R; Operating Temperature: -55°C ~ 85°C; Features: -; Ratings: -; Applications: General Purpose; Failure Rate: -; Mounting Type: Surface Mount, MLCC; Package / Case: 0603 (1608 Metric); Size / Dimension: 0.063" L x 0.031" W (1.60mm x 0.80mm); Height - Seated (Max): -; Thickness (Max): 0.035" (0.90mm); Lead Spacing: -; Lead Style: -; ComponentLink1URL: http://www.yageo.com/documents/recent/UPY-GPHC_X5R_4V-to-50V_24.pdf; ComponentLink1Description: http://www.yageo.com/documents/recent/UPY-GPHC_X5R_4V-to-50V_24.pdf; Value: 10uF
C3.5 C4.5 C5.5 C6.5 = CC0603KRX7R0BB104: CAP CER 0.1UF 100V X7R 0603; Manufacturer: Yageo; Tolerance: ±10%; Supplier 1: Digi-Key; Manufacturer Part Number: CC0603KRX7R0BB104; RoHS: RoHS Compliant; Category: Capacitors; Stock 1: 784508; Pricing 1: 1=0.23, 10=0.156, 100=0.0791, 500=0.05414, 1000=0.0479 (USD); Packaging: Cut Tape (CT); Part Status: Active; Temperature Coefficient: X7R; Operating Temperature: -55°C ~ 125°C; Features: -; Ratings: -; Applications: General Purpose; Failure Rate: -; Mounting Type: Surface Mount, MLCC; Package / Case: 0603 (1608 Metric); Size / Dimension: 0.063" L x 0.032" W (1.60mm x 0.80mm); Height - Seated (Max): -; Thickness (Max): 0.035" (0.90mm); Lead Spacing: -; Lead Style: -; ComponentLink1URL: http://media.digikey.com/pdf/Data%20Sheets/Yageo%20PDFs/NPO,%20X7R%20Mid-voltage.pdf; ComponentLink1Description: http://media.digikey.com/pdf/Data%20Sheets/Yageo%20PDFs/NPO,%20X7R%20Mid-voltage.pdf; Supplier Part Number 1: 311-1523-1-ND; Value: 100nF; Voltage - Rated: 100V
D1.5 D2.5 D3.5 D4.5 = LED RBR 5050 - IN-PI55QATPRPGPBPW-60: Address Led Discrete Serial Rgbw; Manufacturer: Inolux; Color: White,Blue,Green,Red; Lens Style: Round,Flat; Luminous Intensity: 1850mcd; Forward Voltage: 5.2V; Test Current: 12mA; Dominant Wavelength: 465nm; Supplier 1: Arrow Electronics; Manufacturer Part Number: IN-PI55QATPRPGPBPW-60; RoHS: No; Category: LEDs; Stock 1: 964; Pricing 1: 1=0.71450, 10=0.46990, 25=0.46520, 100=0.30470, 250=0.30220, 500=0.29430 (USD); Mount: Surface Mount; Case/Package: SMD/SMT; Packaging: Tape and Reel; Length: 5mm; Width: 5mm; Height: 1.7mm; ComponentLink1URL: http://www.inolux-corp.com/datasheet/SMDLED/Addressable%20LED/IN-PI55QATPRPGPBPW-XX_v1.2.pdf?src-supplier=Digi-Key; ComponentLink1Description: http://www.inolux-corp.com/datasheet/SMDLED/Addressable%20LED/IN-PI55QATPRPGPBPW-XX_v1.2.pdf?src-supplier=Digi-Key; Supplier Part Number 1: IN-PI55QATPRPGPBPW-60
R1.5 = RC0603JR-07330RL: RES SMD 330 OHM 5% 1/10W 0603; Manufacturer 1: Yageo; Category 1: Resistors; Resistance (Ohms): 330; Power (Watts): 0.1W, 1/10W; Temperature Coefficient: ±100ppm/°C; Value: 330R; Supplier 1: Digi-Key; Supplier Part Number 1: 311-330GRCT-ND; Manufacturer Part Number 1: RC0603JR-07330RL; RoHS 1: RoHS Compliant; Description 1: RES SMD 330 OHM 5% 1/10W 0603; Stock 1: 1463213; Pricing 1: 1=0.1, 10=0.011, 100=0.0046, 1000=0.00207, 2500=0.0018 (USD); Packaging: Cut Tape (CT); Part Status: Active; Tolerance: ±5%; Composition: Thick Film; Features: Moisture Resistant; Operating Temperature: -55°C ~ 155°C; Package / Case: 0603 (1608 Metric); Supplier Device Package: 0603; Size / Dimension: 0.063" L x 0.031" W (1.60mm x 0.80mm); Height - Seated (Max): 0.022" (0.55mm); Failure Rate: -; ComponentLink1URL: http://www.yageo.com/documents/recent/PYu-RC_Group_51_RoHS_L_7.pdf; ComponentLink1Description: http://www.yageo.com/documents/recent/PYu-RC_Group_51_RoHS_L_7.pdf

## Sheet [6] Radio Frequency.SchDoc
size A4; Organization: UNMEI ELECTRICAL; Address1: 16B/12 Nguyen Du Street; Address2: Da Lat City, LD Province; SheetNumber: 6; SheetTotal: 7
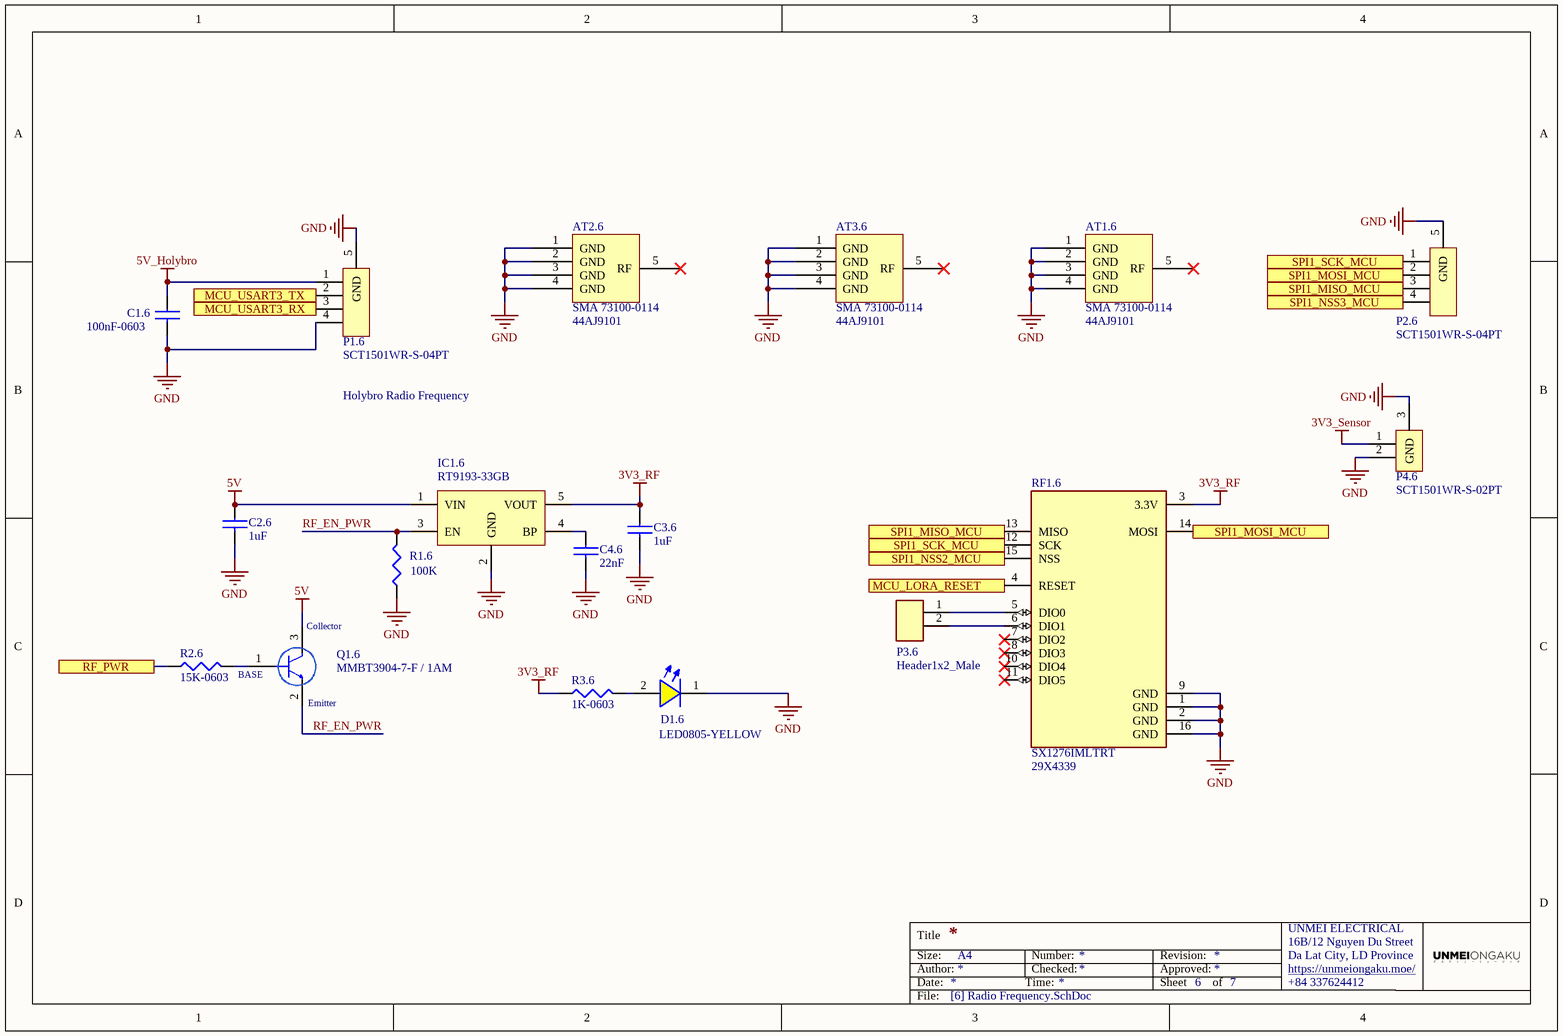
[diagram p5: [6] Radio Frequency.SchDoc]

### Parts
AT1.6  SMA 73100-0114  Supplier Part Number 1: 44AJ9101  [SMA Antenna Connection Jack]
AT2.6  SMA 73100-0114  Supplier Part Number 1: 44AJ9101  [SMA Antenna Connection Jack]
AT3.6  SMA 73100-0114  Supplier Part Number 1: 44AJ9101  [SMA Antenna Connection Jack]
C1.6  100nF-0603  [CAP0603]
C2.6  1uF  [CAP0603]
C3.6  1uF  [CAP0603]
C4.6  22nF  [CAP0603]
D1.6  LED0805-YELLOW  [LED0805-YELLOW]
IC1.6  RT9193-33GB  [SOT23-5]
P1.6  SCT1501WR-S-04PT  [Connector ZH1.5 4P SMD]
P2.6  SCT1501WR-S-04PT  [Connector ZH1.5 4P SMD]
P3.6  Header1x2_Male  [HDR1x2_2.54_MALE]
P4.6  SCT1501WR-S-02PT  [Connector ZH1.5 2P SMD]
Q1.6  MMBT3904-7-F / 1AM  [SOT23]
R1.6  100K  [RES0603 - 3D]
R2.6  15K-0603  [RES0603 - 3D]
R3.6  1K-0603  [RES0603 - 3D]
RF1.6  SX1276IMLTRT  Supplier Part Number 1: 29X4339  [Lora SX1278 433MHz  / Ai-Thinker Ra-02]

### Ports
MCU_LORA_RESET, MCU_USART3_RX, MCU_USART3_TX, RF_PWR, SPI1_MISO_MCU, SPI1_MOSI_MCU, SPI1_NSS2_MCU, SPI1_NSS3_MCU, SPI1_SCK_MCU

### Nets
3V3_RF: C3.6.1 IC1.6.5(VOUT) R3.6.1 RF1.6.3(3.3V)
3V3_Sensor: P4.6.1
5V: C1.6.1 C2.6.1 IC1.6.1(VIN) P1.6.1 Q1.6.3  [also labelled 5V_Holybro]
GND: AT1.6.1(GND) AT1.6.2(GND) AT1.6.3(GND) AT1.6.4(GND) AT2.6.1(GND) AT2.6.2(GND) AT2.6.3(GND) AT2.6.4(GND) AT3.6.1(GND) AT3.6.2(GND) AT3.6.3(GND) AT3.6.4(GND) C1.6.2 C2.6.2 C3.6.2 C4.6.2 D1.6.1(+) IC1.6.2(GND) P1.6.4 P1.6.5(GND) P2.6.5(GND) P4.6.2 P4.6.3(GND) R1.6.1 RF1.6.1(GND) RF1.6.2(GND) RF1.6.9(GND) RF1.6.16(GND)
RF_EN_PWR: IC1.6.3(EN) Q1.6.2 R1.6.2
NetC4.6_1: C4.6.1 IC1.6.4(BP)
NetD1.6_2: D1.6.2(+) R3.6.2
NetP1.6_2: P1.6.2 ; port MCU_USART3_TX
NetP1.6_3: P1.6.3 ; port MCU_USART3_RX
NetP2.6_1: P2.6.1 RF1.6.12(SCK) ; port SPI1_SCK_MCU
NetP2.6_2: P2.6.2 RF1.6.14(MOSI) ; port SPI1_MOSI_MCU
NetP2.6_3: P2.6.3 RF1.6.13(MISO) ; port SPI1_MISO_MCU
NetP2.6_4: P2.6.4 ; port SPI1_NSS3_MCU
NetP3.6_1: P3.6.1 RF1.6.5(DIO0)
NetP3.6_2: P3.6.2 RF1.6.6(DIO1)
NetQ1.6_1: Q1.6.1 R2.6.2
NetR2.6_1: R2.6.1 ; port RF_PWR
NetRF1.6_4: RF1.6.4(RESET) ; port MCU_LORA_RESET
NetRF1.6_15: RF1.6.15(NSS) ; port SPI1_NSS2_MCU

Not connected (* = marked no-connect by the designer): AT1.6 5(RF)*; AT2.6 5(RF)*; AT3.6 5(RF)*; RF1.6 7(DIO2)* 8(DIO3)* 10(DIO4)* 11(DIO5)*

### Notes on the sheet
- Holybro Radio Frequency
- Title
- Size:
- Date:
- Author:
- A4
- Time:
- Number:
- Checked:
- Revision:
- Sheet
- Approved:
- of
- https://unmeiongaku.moe/
- +84 337624412
- File:
- (in symbol MMBT3904-7-F / 1AM) Collector; BASE; Emitter

### Library data of the parts
AT1.6 AT2.6 AT3.6 = SMA 73100-0114: RF SMA Connector, 1 Contact(s), Female, Board Mount, Solder Terminal, Locking, Receptacle; Manufacturer: Molex; Body Material: Brass; Body Plating: Gold; Dielectric Material: PTFE; Polarity: Normal; Connector Type: PCB,SMA,Coaxial; Impedance: 50R; Frequency: 12Hz; Operating Frequency: 0 to 12Hz; Max Frequency: 18GHz; Voltage Rating: 500V; Supplier 1: Newark; Manufacturer Part Number: 73100-0114; RoHS: Yes; Category: RF / Coaxial Connectors; Stock 1: 2371; Pricing 1: 1=8.21000, 5=7.67000, 10=7.13000, 25=6.72000, 50=6.30000, 100=5.89000 (USD); Mount: Through Hole; Case/Package: SMA; Contact Plating: Gold; Contact Material: Copper; Insulation Material: Teflon; Housing Color: Gold; Plating: Gold; Center Contact Plating: Gold; Min Operating Temperature: -65°C; Max Operating Temperature: 165°C; Package Quantity: 1760; Packaging: Tray; Series: 73100; Termination: Solder; Orientation: Right Angle; Gender: Female; Fastening Type: Threaded; Length: 14.8mm; Radiation Hardening: No; RoHS Compliant: Yes
C1.6 = CC0603KRX7R9BB104: as C3.4 on sheet [4] Wifi_ESP32_Antenna; Supplier 1: Digi-Key; Supplier Part Number 1: 311-1344-1-ND; Manufacturer Part Number 1: CC0603KRX7R9BB104; RoHS 1: RoHS Compliant; Description 1: CAP CER 0.1UF 50V X7R 0603; Stock 1: 4411645; Pricing 1: 1=0.1, 10=0.031, 100=0.014, 500=0.00998, 1000=0.00783 (USD); Packaging: Cut Tape (CT); Part Status: Active; Voltage - Rated: 50V; Temperature Coefficient: X7R; Operating Temperature: -55°C ~ 125°C; Features: -; Ratings: -; Applications: General Purpose; Failure Rate: -; Mounting Type: Surface Mount, MLCC; Package / Case: 0603 (1608 Metric); Size / Dimension: 0.063" L x 0.031" W (1.60mm x 0.80mm); Height - Seated (Max): -; Thickness (Max): 0.035" (0.90mm); Lead Spacing: -; Lead Style: -; ComponentLink1URL: http://www.yageo.com/documents/recent/UPY-GPHC_X7R_6.3V-to-50V_18.pdf; ComponentLink1Description: http://www.yageo.com/documents/recent/UPY-GPHC_X7R_6.3V-to-50V_18.pdf
C2.6 C3.6 = CC0603KRX7R7BB105: as C4.4 on sheet [4] Wifi_ESP32_Antenna; Supplier 1: Digi-Key; Supplier Part Number 1: 311-1446-1-ND; Manufacturer Part Number 1: CC0603KRX7R7BB105; RoHS 1: RoHS Compliant; Description 1: CAP CER 1UF 16V X7R 0603; Stock 1: 274580; Pricing 1: 1=0.1, 10=0.051, 100=0.0227, 500=0.0162, 1000=0.01274 (USD); Packaging: Cut Tape (CT); Part Status: Active; Voltage - Rated: 16V; Temperature Coefficient: X7R; Operating Temperature: -55°C ~ 125°C; Features: -; Ratings: -; Applications: General Purpose; Failure Rate: -; Mounting Type: Surface Mount, MLCC; Package / Case: 0603 (1608 Metric); Size / Dimension: 0.063" L x 0.031" W (1.60mm x 0.80mm); Height - Seated (Max): -; Thickness (Max): 0.035" (0.90mm); Lead Spacing: -; Lead Style: -; ComponentLink1URL: http://www.yageo.com/documents/recent/UPY-GPHC_X7R_6.3V-to-50V_18.pdf; ComponentLink1Description: http://www.yageo.com/documents/recent/UPY-GPHC_X7R_6.3V-to-50V_18.pdf; Value: 1uF
C4.6 = CC0603KRX7R9BB223: Multilayer Ceramic Capacitors MLCC - SMD/SMT 22nF 50V X7R 10%; Manufacturer: Yageo; Capacitance: 0.022 uF; Type: General Purpose and High Capacitance Surface Mount Ceramic Multilayer Capacitor; Voltage Rating DC: 50 VDC; Capacitance - pF: 22000 pF; Class: Class 2; Supplier 1: Mouser; Manufacturer Part Number: CC0603KRX7R9BB223; RoHS: RoHS Compliant; Category: Multilayer Ceramic Capacitors MLCC - SMD/SMT; Stock 1: 23033; Pricing 1: 1=0.100, 10=0.064, 100=0.020, 1000=0.015, 4000=0.011, 8000=0.010, 24000=0.009 (USD); Height: 0.8 mm; Length: 1.6 mm; Package / Case: 0603 (1608 metric); Packaging: Cut Tape; Product: General Type MLCCs; Series: CC; Termination Style: SMD/SMT; Tolerance: 10 %; Width: 0.8 mm; Brand: Yageo; Capacitance - nF: 22 nF; Case Code - in: 0603; Case Code - mm: 1608; Dielectric: X7R; Maximum Operating Temperature: + 125 C; Minimum Operating Temperature: - 55 C; Product Type: Ceramic Capacitors; Standard Pack Qty: 4000; Subcategory: Capacitors; Termination: Standard; RoHS - Mouser: Y; Minimum Order Quantity: 1; Reeling: True; ComponentLink1URL: https://www.mouser.com/datasheet/2/447/UPY-GPHC_X7R_6.3V-to-50V_18-1154002.pdf; ComponentLink1Description: https://www.mouser.com/datasheet/2/447/UPY-GPHC_X7R_6.3V-to-50V_18-1154002.pdf; Supplier Part Number 1: 603-CC603KRX7R9BB223; Value: 22nF
IC1.6 = RT9193-33GB: IC REG LDO 3.3V 0.3A SOT23-5
P3.6 = HDR1x2_2.54_MALE: Header1x2_2.54_MALE
Q1.6 = MMBT3904-7-F / 1AM: Transistor General Purpose BJT NPN 40 Volt 0.2A Automotive 3-Pin SOT-23; Manufacturer: Diodes Zetex; Collector Emitter Breakdown Voltage: 40V; Max Power Dissipation: 300mW; Max Collector Current: 200mA; Transition Frequency: 300MHz; Collector Base Voltage (VCBO): 60V; Emitter Base Voltage (VEBO): 6V; Collector Emitter Saturation Voltage: 300mV; Element Configuration: Single; hFE Min: 100; Power Dissipation: 350mW; Number of Elements: 1; Supplier 1: Digi-Key; Manufacturer Part Number: MMBT3904-7-F; RoHS: Yes; Category: BJTs; Stock 1: 468030; Pricing 1: 3000=0.02271, 6000=0.02048, 15000=0.01781, 30000=0.01603, 75000=0.01425 (USD); Mount: Surface Mount; Case/Package: SOT-23; Number of Pins: 3; Contact Plating: Tin,Matte; Weight: 0.000282oz; Min Operating Temperature: -55°C; Max Operating Temperature: 150°C; Packaging: Tape and Reel; Polarity: NPN; Package Quantity: 3000; Collector Emitter Voltage (VCEO): 40V; Gain Bandwidth Product: 300MHz; Frequency: 300MHz; Max Breakdown Voltage: 40V; Series: -; Collector-emitter Voltage-Max: 300mV; Voltage Rating (DC): 40V; Max Frequency: 300MHz; Continuous Collector Current: 200mA; Length: 3.05mm; Width: 1.4mm; Height: 1mm; Radiation Hardening: No; RoHS Compliant: Yes; Lead Free: Lead Free; REACH SVHC: No SVHC; ComponentLink1URL: https://datasheet.ciiva.com/11201/ds30036-11201778.pdf?src-supplier=Avnet; ComponentLink1Description: https://datasheet.ciiva.com/11201/ds30036-11201778.pdf?src-supplier=Avnet; ComponentLink2URL: https://datasheet.ciiva.com/15138/getdatasheetpartid-53265-15138780.pdf?src-supplier=Verical; ComponentLink2Description: https://datasheet.ciiva.com/15138/getdatasheetpartid-53265-15138780.pdf?src-supplier=Verical; ComponentLink3URL: https://datasheet.ciiva.com/22711/1915516-22711750.pdf?src-supplier=Element14; ComponentLink3Description: https://datasheet.ciiva.com/22711/1915516-22711750.pdf?src-supplier=Element14; ComponentLink4URL: https://datasheet.ciiva.com/11198/ds30036-11198999.pdf?src-supplier=Avnet; ComponentLink4Description: https://datasheet.ciiva.com/11198/ds30036-11198999.pdf?src-supplier=Avnet; ComponentLink5URL: https://datasheet.ciiva.com/6361/ds30036-6361256.pdf?src-supplier=Digi-Key; ComponentLink5Description: https://datasheet.ciiva.com/6361/ds30036-6361256.pdf?src-supplier=Digi-Key; ComponentLink6URL: https://datasheet.ciiva.com/6361/ds30036-6361254.pdf?src-supplier=Digi-Key; ComponentLink6Description: https://datasheet.ciiva.com/6361/ds30036-6361254.pdf?src-supplier=Digi-Key; Supplier Part Number 1: MMBT3904-FDITR-ND
R1.6 = RC0603JR-07100KL: RES SMD 100K OHM 5% 1/10W 0603; Manufacturer 1: Yageo; Category 1: Resistors; Power (Watts): 0.1W, 1/10W; Temperature Coefficient: ±100ppm/°C; Supplier 1: Digi-Key; Supplier Part Number 1: 311-100KGRCT-ND; Manufacturer Part Number 1: RC0603JR-07100KL; RoHS 1: RoHS Compliant; Description 1: RES SMD 100K OHM 5% 1/10W 0603; Stock 1: 3591837; Pricing 1: 1=0.1, 10=0.011, 100=0.0044, 1000=0.00198, 2500=0.00172 (USD); Packaging: Cut Tape (CT); Part Status: Active; Resistance (Ohms): 100k; Tolerance: ±5%; Composition: Thick Film; Features: Moisture Resistant; Operating Temperature: -55°C ~ 155°C; Package / Case: 0603 (1608 Metric); Supplier Device Package: 0603; Size / Dimension: 0.063" L x 0.031" W (1.60mm x 0.80mm); Height - Seated (Max): 0.022" (0.55mm); Failure Rate: -; ComponentLink1URL: http://www.yageo.com/documents/recent/PYu-RC_Group_51_RoHS_L_7.pdf; ComponentLink1Description: http://www.yageo.com/documents/recent/PYu-RC_Group_51_RoHS_L_7.pdf; Value: 100K
R2.6 = RC0603JR-0715KL: Thick Film Resistors - SMD 15K OHM 5%; Manufacturer: Yageo; Power Rating: 100 mW, 200 mW; Resistance: 15 kOhms; Temperature Coefficient: 100 PPM / C; Voltage Rating: 75 V; Supplier 1: Mouser; Manufacturer Part Number: RC0603JR-0715KL; RoHS: RoHS Compliant; Category: Thick Film Resistors - SMD; Stock 1: 39889; Pricing 1: 1=0.100, 10=0.015, 100=0.005, 1000=0.004, 5000=0.004 (USD); Application: High Reliability; Features: -; Height: 0.45 mm; Length: 1.6 mm; Package / Case: 0603 (1608 metric); Packaging: Cut Tape; Product: Thick Film Resistors SMD; Series: RC; Technology: Thick Film; Termination Style: SMD/SMT; Tolerance: 5 %; Type: General Purpose; Width: 0.8 mm; Brand: Yageo; Mounting Style: PCB Mount; Case Code - in: 0603; Case Code - mm: 1608; Maximum Operating Temperature: + 155 C; Minimum Operating Temperature: - 55 C; Product Type: Thick Film Resistors; Standard Pack Qty: 5000; Subcategory: Resistors; RoHS - Mouser: Y; Minimum Order Quantity: 1; Reeling: True; ComponentLink1URL: http://www.mouser.com/datasheet/2/447/PYu-RC_Group_51_RoHS_L_9-1314892.pdf; ComponentLink1Description: http://www.mouser.com/datasheet/2/447/PYu-RC_Group_51_RoHS_L_9-1314892.pdf; Supplier Part Number 1: 603-RC0603JR-0715KL; Value: 15K
R3.6 = RC0603JR-071KL: as R4.4 on sheet [4] Wifi_ESP32_Antenna; Supplier 1: Digi-Key; Supplier Part Number 1: 311-1.0KGRCT-ND; Manufacturer Part Number 1: RC0603JR-071KL; RoHS 1: RoHS Compliant; Description 1: RES SMD 1K OHM 5% 1/10W 0603; Stock 1: 2853955; Pricing 1: 1=0.1, 10=0.011, 100=0.0044, 1000=0.00198, 2500=0.00172 (USD); Packaging: Cut Tape (CT); Part Status: Active; Resistance (Ohms): 1k; Tolerance: ±5%; Composition: Thick Film; Features: Moisture Resistant; Operating Temperature: -55°C ~ 155°C; Package / Case: 0603 (1608 Metric); Supplier Device Package: 0603; Size / Dimension: 0.063" L x 0.031" W (1.60mm x 0.80mm); Height - Seated (Max): 0.022" (0.55mm); Failure Rate: -; ComponentLink1URL: http://www.yageo.com/documents/recent/PYu-RC_Group_51_RoHS_L_7.pdf; ComponentLink1Description: http://www.yageo.com/documents/recent/PYu-RC_Group_51_RoHS_L_7.pdf; Value: 1K
RF1.6 = SX1276IMLTRT: Rf Ism Transceiver Fsk/gfsk/gmsk/msk/ook 3.3V Automotive 28-PIN QFN Ep T/r; Manufacturer: Semtech; Frequency: 137MHz; Data Rate: 300Kbps; Sensitivity: -148dBm; Number of GPIO: 6; Interface: SPI; Current - Receiving: 12mA; Current - Transmitting: 120mA; Operating Supply Voltage: 3.7V; Supplier 1: Newark; Manufacturer Part Number: SX1276IMLTRT; RoHS: Yes; Category: RF Receivers, Transceivers; Stock 1: 2848; Pricing 1: 1=9.90000, 10=9.04000, 25=8.28000, 50=7.88000, 100=7.47000, 250=6.87000, 500=6.24000 (USD); Case/Package: VQFN; Min Operating Temperature: -40°C; Max Operating Temperature: 85°C; Packaging: Tape and Reel; Package Quantity: 3000; Lead Free: Lead Free; RoHS Compliant: Yes; ComponentLink1URL: https://datasheet.ciiva.com/29635/sx1276-29635606.pdf?src-supplier=Digi-Key; ComponentLink1Description: https://datasheet.ciiva.com/29635/sx1276-29635606.pdf?src-supplier=Digi-Key; ComponentLink2URL: https://datasheet.ciiva.com/29635/sx1276-29635607.pdf?src-supplier=Digi-Key; ComponentLink2Description: https://datasheet.ciiva.com/29635/sx1276-29635607.pdf?src-supplier=Digi-Key; ComponentLink3URL: https://datasheet.ciiva.com/29635/sx1276-29635605.pdf?src-supplier=Digi-Key; ComponentLink3Description: https://datasheet.ciiva.com/29635/sx1276-29635605.pdf?src-supplier=Digi-Key

## Sheet [7] Motor_Control.SchDoc
size A4; Organization: UNMEI ELECTRICAL; Address1: 16B/12 Nguyen Du Street; Address2: Da Lat City, LD Province; SheetNumber: 7; SheetTotal: 7
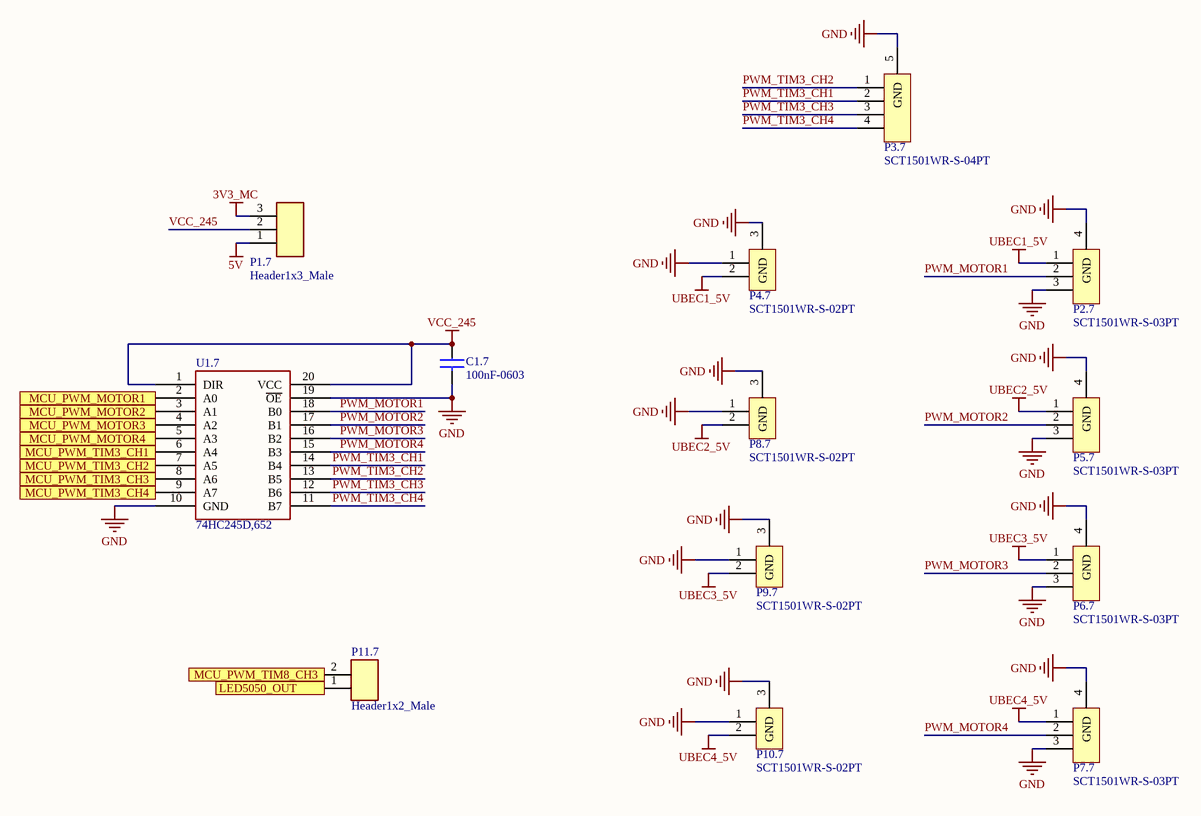
[diagram p6: [7] Motor_Control.SchDoc]

### Parts
C1.7  100nF-0603  [CAP0603]
P1.7  Header1x3_Male  [HDR1x3_2.54_MALE]
P2.7  SCT1501WR-S-03PT  [Connector ZH1.5 3P SMD]
P3.7  SCT1501WR-S-04PT  [Connector ZH1.5 4P SMD]
P4.7  SCT1501WR-S-02PT  [Connector ZH1.5 2P SMD]
P5.7  SCT1501WR-S-03PT  [Connector ZH1.5 3P SMD]
P6.7  SCT1501WR-S-03PT  [Connector ZH1.5 3P SMD]
P7.7  SCT1501WR-S-03PT  [Connector ZH1.5 3P SMD]
P8.7  SCT1501WR-S-02PT  [Connector ZH1.5 2P SMD]
P9.7  SCT1501WR-S-02PT  [Connector ZH1.5 2P SMD]
P10.7  SCT1501WR-S-02PT  [Connector ZH1.5 2P SMD]
P11.7  Header1x2_Male  [HDR1x2_2.54_MALE]
U1.7  74HC245D,652  [SOT163-1_NEX]

### Ports
LED5050_OUT, MCU_PWM_MOTOR1, MCU_PWM_MOTOR2, MCU_PWM_MOTOR3, MCU_PWM_MOTOR4, MCU_PWM_TIM3_CH1, MCU_PWM_TIM3_CH2, MCU_PWM_TIM3_CH3, MCU_PWM_TIM3_CH4, MCU_PWM_TIM8_CH3

### Nets
3V3_MC: P1.7.3
5V: P1.7.1
GND: C1.7.2 P2.7.3 P2.7.4(GND) P3.7.5(GND) P4.7.1 P4.7.3(GND) P5.7.3 P5.7.4(GND) P6.7.3 P6.7.4(GND) P7.7.3 P7.7.4(GND) P8.7.1 P8.7.3(GND) P9.7.1 P9.7.3(GND) P10.7.1 P10.7.3(GND) U1.7.10(GND) U1.7.19(~{OE})
UBEC1_5V: P2.7.1 P4.7.2
UBEC2_5V: P5.7.1 P8.7.2
UBEC3_5V: P6.7.1 P9.7.2
UBEC4_5V: P7.7.1 P10.7.2
VCC_245: C1.7.1 P1.7.2 U1.7.1(DIR) U1.7.20(VCC)
PWM_MOTOR1: P2.7.2 U1.7.18(B0)
PWM_MOTOR2: P5.7.2 U1.7.17(B1)
PWM_MOTOR3: P6.7.2 U1.7.16(B2)
PWM_MOTOR4: P7.7.2 U1.7.15(B3)
PWM_TIM3_CH1: P3.7.2 U1.7.14(B4)
PWM_TIM3_CH2: P3.7.1 U1.7.13(B5)
PWM_TIM3_CH3: P3.7.3 U1.7.12(B6)
PWM_TIM3_CH4: P3.7.4 U1.7.11(B7)
NetD4.5_2: P11.7.1 ; port LED5050_OUT
NetP11.7_2: P11.7.2 ; port MCU_PWM_TIM8_CH3
NetU1.2_26: U1.7.8(A6) ; port MCU_PWM_TIM3_CH3
NetU1.2_27: U1.7.9(A7) ; port MCU_PWM_TIM3_CH4
NetU1.2_41: U1.7.2(A0) ; port MCU_PWM_MOTOR1
NetU1.2_42: U1.7.3(A1) ; port MCU_PWM_MOTOR2
NetU1.2_43: U1.7.4(A2) ; port MCU_PWM_MOTOR3
NetU1.2_44: U1.7.5(A3) ; port MCU_PWM_MOTOR4
NetU1.2_56: U1.7.6(A4) ; port MCU_PWM_TIM3_CH1
NetU1.2_57: U1.7.7(A5) ; port MCU_PWM_TIM3_CH2

### Notes on the sheet
- Title
- Size:
- Date:
- Author:
- A4
- Time:
- Number:
- Checked:
- Revision:
- Sheet
- Approved:
- of
- https://unmeiongaku.moe/
- +84 337624412
- File:

### Library data of the parts
C1.7 = CC0603KRX7R9BB104: as C3.4 on sheet [4] Wifi_ESP32_Antenna; Supplier 1: Digi-Key; Supplier Part Number 1: 311-1344-1-ND; Manufacturer Part Number 1: CC0603KRX7R9BB104; RoHS 1: RoHS Compliant; Description 1: CAP CER 0.1UF 50V X7R 0603; Stock 1: 4411645; Pricing 1: 1=0.1, 10=0.031, 100=0.014, 500=0.00998, 1000=0.00783 (USD); Packaging: Cut Tape (CT); Part Status: Active; Voltage - Rated: 50V; Temperature Coefficient: X7R; Operating Temperature: -55°C ~ 125°C; Features: -; Ratings: -; Applications: General Purpose; Failure Rate: -; Mounting Type: Surface Mount, MLCC; Package / Case: 0603 (1608 Metric); Size / Dimension: 0.063" L x 0.031" W (1.60mm x 0.80mm); Height - Seated (Max): -; Thickness (Max): 0.035" (0.90mm); Lead Spacing: -; Lead Style: -; ComponentLink1URL: http://www.yageo.com/documents/recent/UPY-GPHC_X7R_6.3V-to-50V_18.pdf; ComponentLink1Description: http://www.yageo.com/documents/recent/UPY-GPHC_X7R_6.3V-to-50V_18.pdf
P1.7 = HDR1x3_2.54_MALE: Header1x3_2.54_MALE
P11.7 = HDR1x2_2.54_MALE: Header1x2_2.54_MALE
U1.7 = 74HC245D,652: Vendor: Nexperia; SourceLibrary: Nexperia_2018-05-2018; Manufacturer_Part_Number: 74HC245D,652; Copyright: Copyright (C) 2016 Accelerated Designs. All rights reserved; RefDes: RefDes; Type: DEV; Local Supplier: thegioiic; Local Supplier Part number: *; Local Supplier Link: https://www.thegioiic.com/products/74hc245d